# EAGLE design DAUGHTER_POWER (EAGLE 7.6.0)
DAUGHTER CARD POWER

## Sheet 1 of 3: HDK INTERFACE
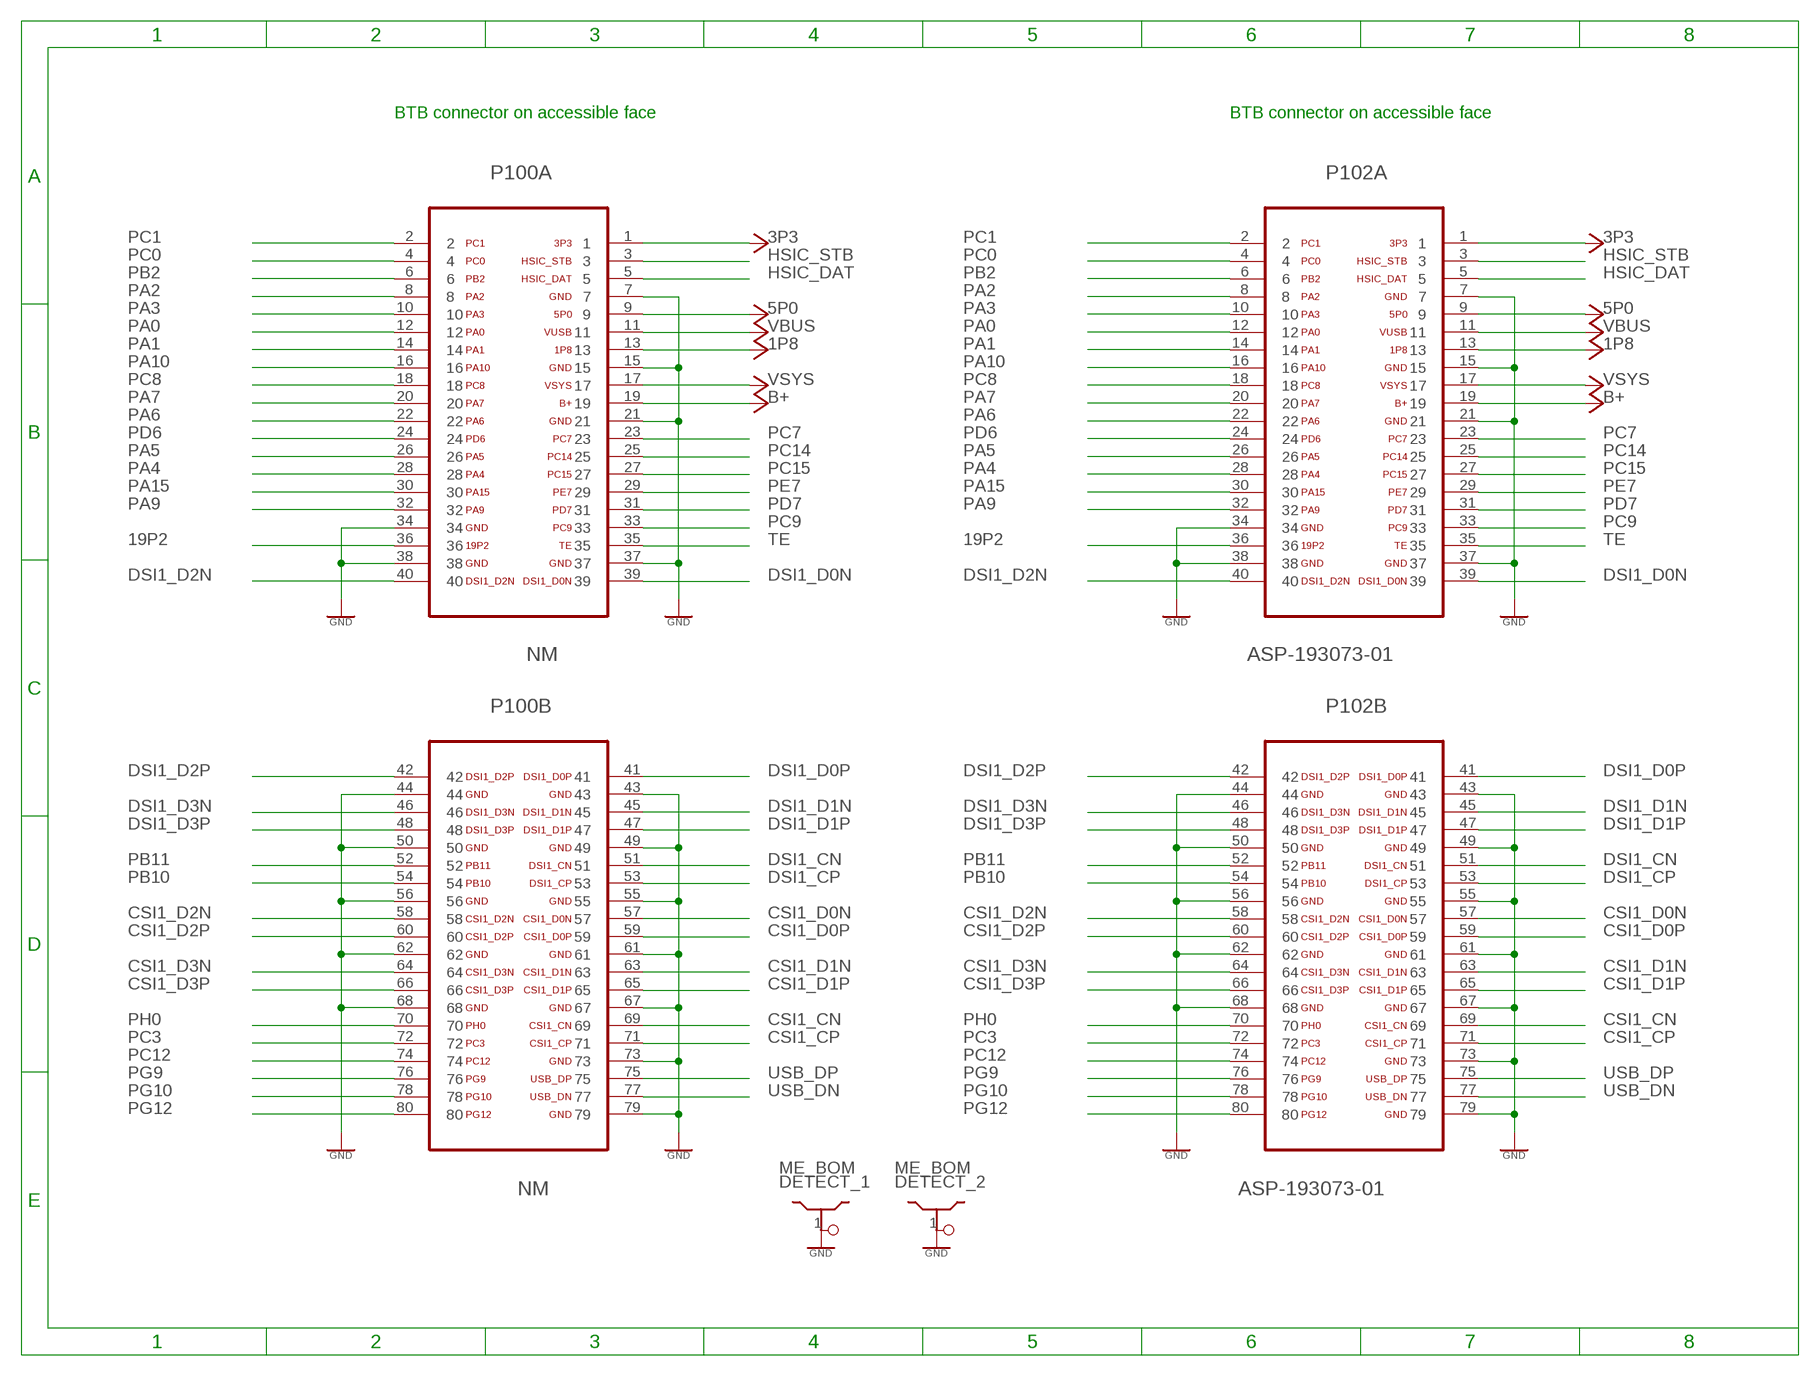
[diagram p0: schematic, sheet 1]

### Parts
DETECT_1  ME_BOM  SHIELDDETECT  [PLUG]
DETECT_2  ME_BOM  SHIELDDETECT  [PLUG]
P100  NM  CLM-140-02-L-D-KGOLD  [CLM-140-02-L-D-K_GOLD]
P102  ASP-193073-01  FTMH-140-02-L-DV-ES-P-TR  [FTMH-140-02-L-DV-ES-P-TR]

### Nets
1P8: P100.13 P102.13 ; also sheet 2,3
3P3: P100.1 P102.1 ; also sheet 2
5P0: P100.9 P102.9
19P2: P100.36 P102.36
B+: P100.19 P102.19
CSI1_CN: P100.69 P102.69
CSI1_CP: P100.71 P102.71
CSI1_D0N: P100.57 P102.57
CSI1_D0P: P100.59 P102.59
CSI1_D1N: P100.63 P102.63
CSI1_D1P: P100.65 P102.65
CSI1_D2N: P100.58 P102.58
CSI1_D2P: P100.60 P102.60
CSI1_D3N: P100.64 P102.64
CSI1_D3P: P100.66 P102.66
DSI1_CN: P100.51 P102.51
DSI1_CP: P100.53 P102.53
DSI1_D0N: P100.39 P102.39
DSI1_D0P: P100.41 P102.41
DSI1_D1N: P100.45 P102.45
DSI1_D1P: P100.47 P102.47
DSI1_D2N: P100.40 P102.40
DSI1_D2P: P100.42 P102.42
DSI1_D3N: P100.46 P102.46
DSI1_D3P: P100.48 P102.48
GND: DETECT_1.1 DETECT_2.1 P100.7 P100.15 P100.21 P100.34 P100.37 P100.38 P100.43 P100.44 P100.49 P100.50 P100.55 P100.56 P100.61 P100.62 P100.67 P100.68 P100.73 P100.79 P102.7 P102.15 P102.21 P102.34 P102.37 P102.38 P102.43 P102.44 P102.49 P102.50 P102.55 P102.56 P102.61 P102.62 P102.67 P102.68 P102.73 P102.79 ; also sheet 2,3
HSIC_DAT: P100.5 P102.5
HSIC_STB: P100.3 P102.3
PA0: P100.12 P102.12
PA1: P100.14 P102.14
PA2: P100.8 P102.8
PA3: P100.10 P102.10
PA4: P100.28 P102.28
PA5: P100.26 P102.26
PA6: P100.22 P102.22
PA7: P100.20 P102.20
PA9: P100.32 P102.32
PA10: P100.16 P102.16
PA15: P100.30 P102.30
PB2: P100.6 P102.6 ; also sheet 3
PB10: P100.54 P102.54 ; also sheet 2,3
PB11: P100.52 P102.52 ; also sheet 2,3
PC0: P100.4 P102.4
PC1: P100.2 P102.2
PC3: P100.72 P102.72
PC7: P100.23 P102.23 ; also sheet 3
PC8: P100.18 P102.18
PC9: P100.33 P102.33
PC12: P100.74 P102.74
PC14: P100.25 P102.25
PC15: P100.27 P102.27
PD6: P100.24 P102.24
PD7: P100.31 P102.31
PE7: P100.29 P102.29
PG9: P100.76 P102.76 ; also sheet 2
PG10: P100.78 P102.78 ; also sheet 3
PG12: P100.80 P102.80 ; also sheet 3
PH0: P100.70 P102.70
TE: P100.35 P102.35
USB_DN: P100.77 P102.77
USB_DP: P100.75 P102.75
VBUS: P100.11 P102.11 ; also sheet 3
VSYS: P100.17 P102.17 ; also sheet 3

### Notes on the sheet
- BTB connector on accessible face | BTB connector on accessible face

## Sheet 2 of 3: Identification
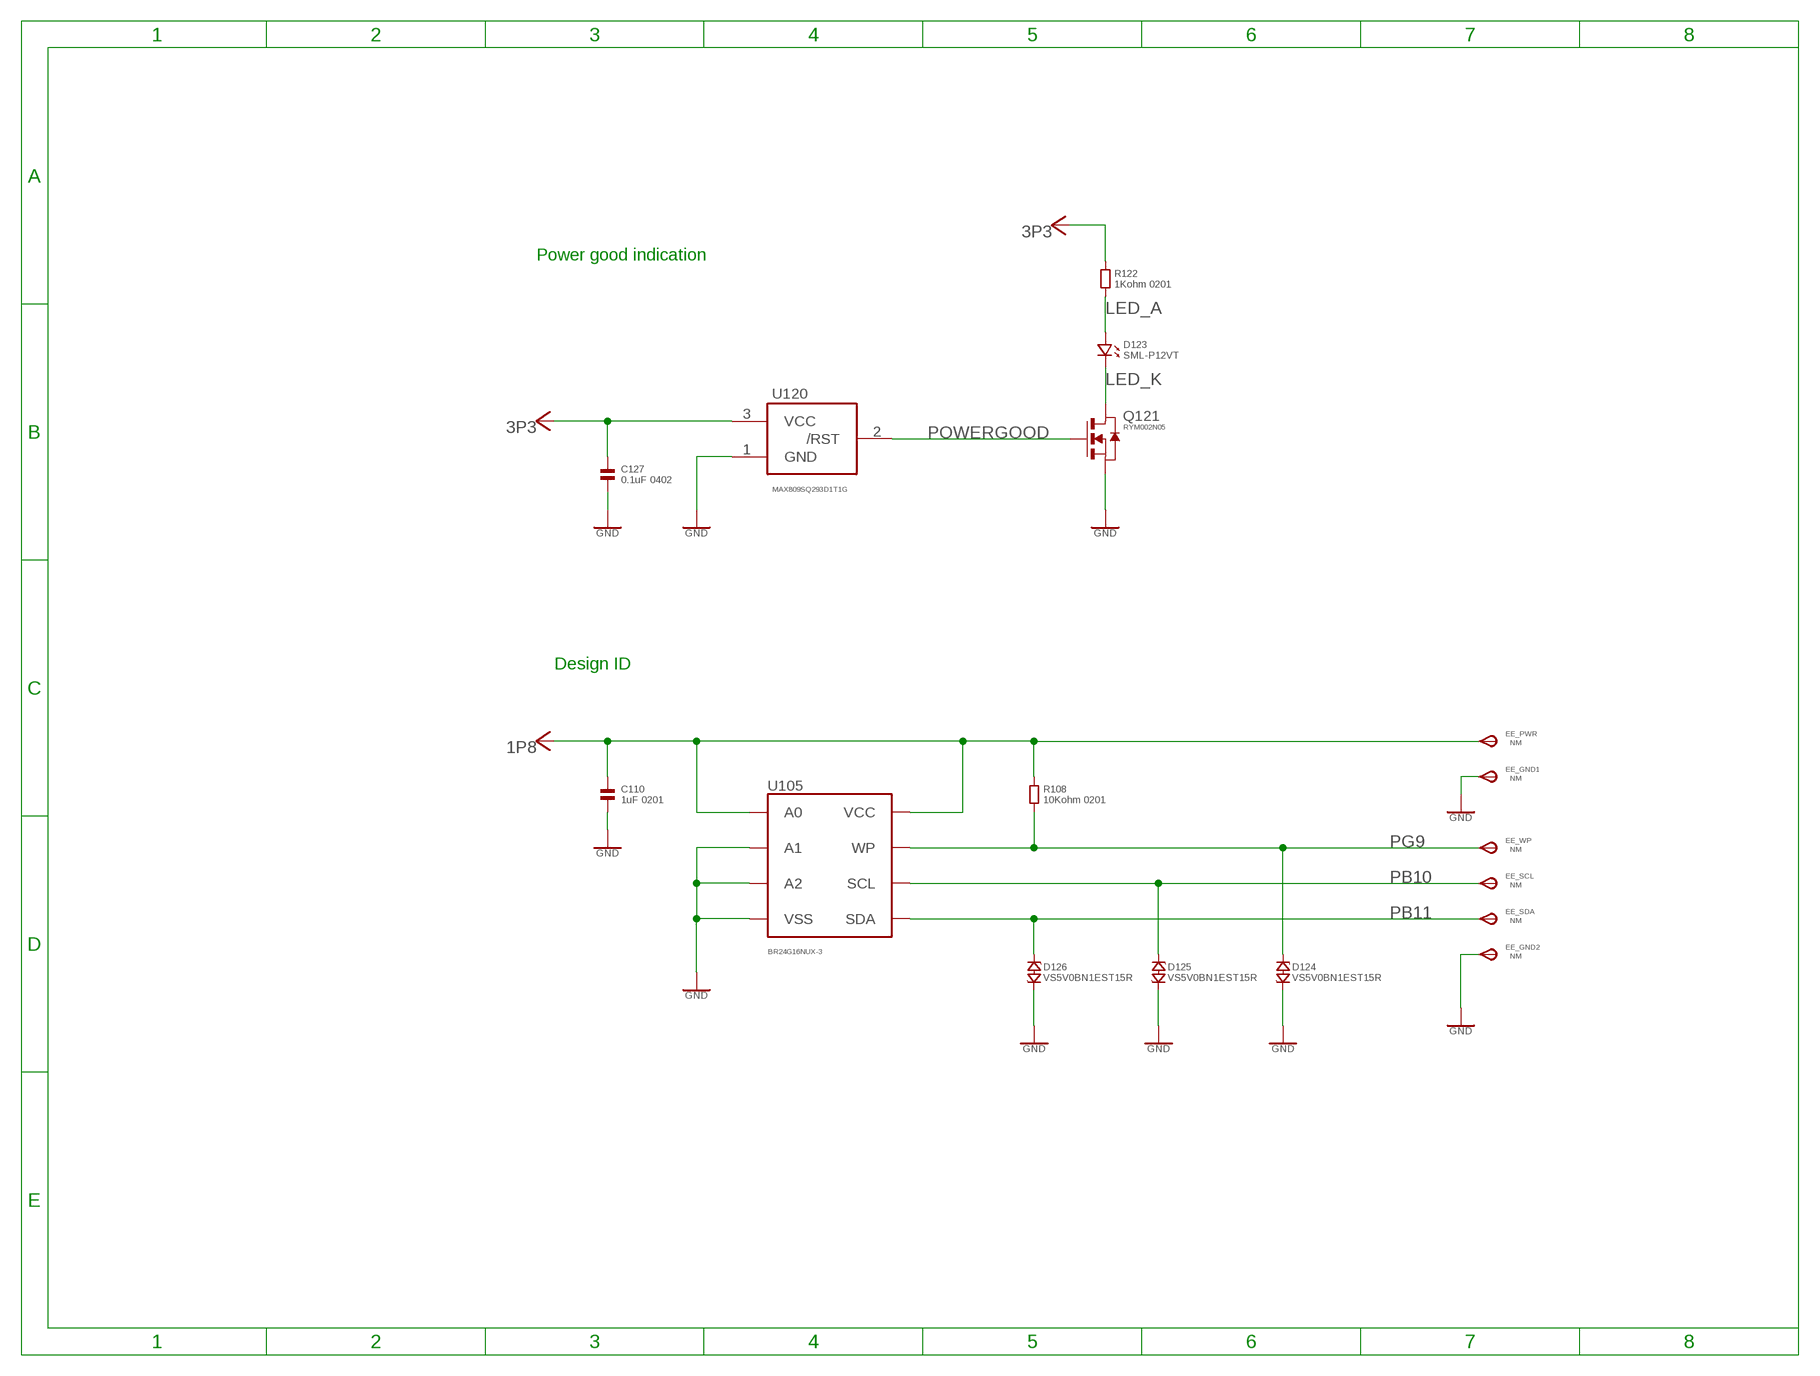
[diagram p1: schematic, sheet 2]

### Parts
C110  1uF 0201  CAPACITOR.0201  [0201]
C127  0.1uF 0402  CAPACITOR.0402  [0402]
D123  SML-P12VT  LED.0503  [0503.LED]
D124  VS5V0BN1EST15R  ESD_VARISTOR.0201  [CHIP_0201]
D125  VS5V0BN1EST15R  ESD_VARISTOR.0201  [CHIP_0201]
D126  VS5V0BN1EST15R  ESD_VARISTOR.0201  [CHIP_0201]
EE_GND1  NM  TPSTP11R  [TP11R]
EE_GND2  NM  TPSTP11R  [TP11R]
EE_PWR  NM  TPSTP11R  [TP11R]
EE_SCL  NM  TPSTP11R  [TP11R]
EE_SDA  NM  TPSTP11R  [TP11R]
EE_WP  NM  TPSTP11R  [TP11R]
Q121  RYM002N05  FET-NRYM002N05  [VMT3]
R108  10Kohm 0201  RESISTOR.0201  [0201]
R122  1Kohm 0201  RESISTOR.0201  [0201]
U105  BR24G16NUX-3  EEPROMDFN8  [DFN-8]
U120  MAX809SQ293D1T1G  MAX809  [SC70-3L]

### Nets
1P8: C110.1 EE_PWR.TP(PP) R108.1 U105.P$1(A0) U105.P$8(VCC) ; also sheet 1,3
3P3: C127.1 R122.1 U120.3(VCC) ; also sheet 1
GND: C110.2 C127.2 D124.P$2 D125.P$2 D126.P$2 EE_GND1.TP(PP) EE_GND2.TP(PP) Q121.2(S) U105.P$2(A1) U105.P$3(A2) U105.P$4(VSS) U105.P$9(VSS) U120.1(GND) ; also sheet 1,3
LED_A: D123.P$1 R122.2
LED_K: D123.P$2 Q121.3(D)
PB10: D125.P$1 EE_SCL.TP(PP) U105.P$6(SCL) ; also sheet 1,3
PB11: D126.P$1 EE_SDA.TP(PP) U105.P$5(SDA) ; also sheet 1,3
PG9: D124.P$1 EE_WP.TP(PP) R108.2 U105.P$7(WP) ; also sheet 1
POWERGOOD: Q121.1(G) U120.2(/RST)

### Notes on the sheet
- Power good indication
- Design ID

## Sheet 3 of 3: BATTERY
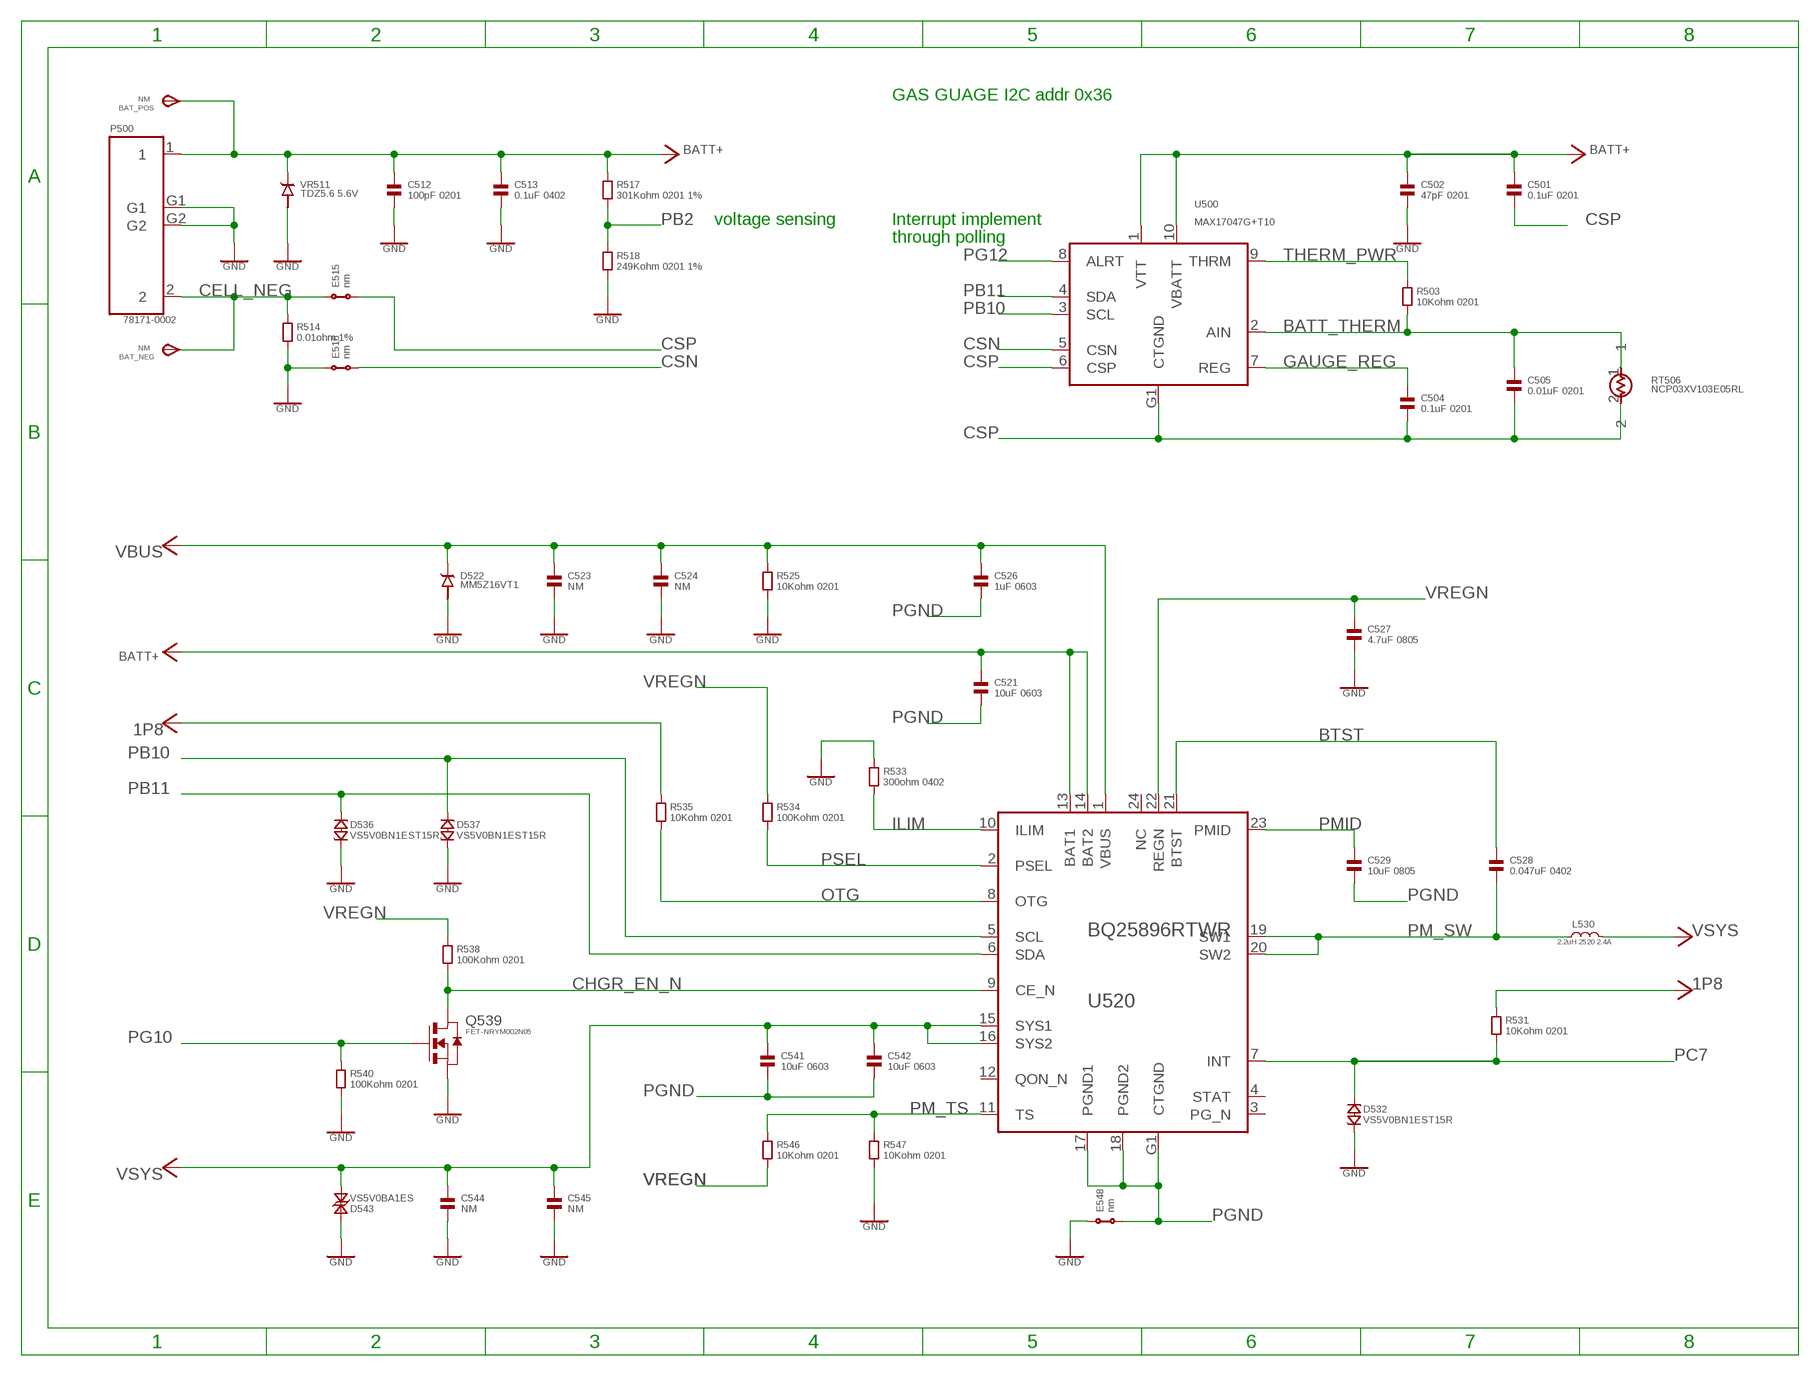
[diagram p2: schematic, sheet 3]

### Parts
BAT_NEG  NM  TPSTP11R  [TP11R]
BAT_POS  NM  TPSTP11R  [TP11R]
C501  0.1uF 0201  CAPACITOR.0201  [0201]
C502  47pF 0201  CAPACITOR.0201  [0201]
C504  0.1uF 0201  CAPACITOR.0201  [0201]
C505  0.01uF 0201  CAPACITOR.0201  [0201]
C512  100pF 0201  CAPACITOR.0201  [0201]
C513  0.1uF 0402  CAPACITOR.0402  [0402]
C521  10uF 0603  CAPACITOR.0603  [0603]
C523  NM  CAPACITOR.0201  [0201]
C524  NM  CAPACITOR.0201  [0201]
C526  1uF 0603  CAPACITOR.0603  [0603]
C527  4.7uF 0805  CAPACITOR.0805  [0805]
C528  0.047uF 0402  CAPACITOR.0402  [0402]
C529  10uF 0805  CAPACITOR.0805  [0805]
C541  10uF 0603  CAPACITOR.0603  [0603]
C542  10uF 0603  CAPACITOR.0603  [0603]
C544  NM  CAPACITOR.0201  [0201]
C545  NM  CAPACITOR.0201  [0201]
D522  MM5Z16VT1  DIODE.SOD523  [SOD523]
D532  VS5V0BN1EST15R  ESD_VARISTOR.0201  [CHIP_0201]
D536  VS5V0BN1EST15R  ESD_VARISTOR.0201  [CHIP_0201]
D537  VS5V0BN1EST15R  ESD_VARISTOR.0201  [CHIP_0201]
D543  VS5V0BA1ES  ESD_TVS.0201  [CHIP_0201]
E515  nm  SHORT_DOT  [SHORT_DOT]
E516  nm  SHORT_DOT  [SHORT_DOT]
E548  nm  SHORT_BAR  [1X4_SHORT]
L530  2.2uH 2520 2.4A  POWER-INDUCTOR  [2520]
P500  78171-0002  CONN_BATT  [CONN_4PIN]
Q539  FET-NRYM002N05  [VMT3]
R503  10Kohm 0201  RESISTOR.0201  [0201]
R514  0.01ohm 1%  RESISTOR.0805  [0805]
R517  301Kohm 0201 1%  RESISTOR.0201  [0201]
R518  249Kohm 0201 1%  RESISTOR.0201  [0201]
R525  10Kohm 0201  RESISTOR.0201  [0201]
R531  10Kohm 0201  RESISTOR.0201  [0201]
R533  300ohm 0402  RESISTOR.0402  [0402]
R534  100Kohm 0201  RESISTOR.0201  [0201]
R535  10Kohm 0201  RESISTOR.0201  [0201]
R538  100Kohm 0201  RESISTOR.0201  [0201]
R540  100Kohm 0201  RESISTOR.0201  [0201]
R546  10Kohm 0201  RESISTOR.0201  [0201]
R547  10Kohm 0201  RESISTOR.0201  [0201]
RT506  NCP03XV103E05RL  THERMISTOR  [0201]
U500  MAX17047G+T10  [DFN3X3_PS0_5P11]
U520  BQ25896RTWR  [QFN4X4PS0_5P25]
VR511  TDZ5.6 5.6V  DIODE  [DIO1_9X1_3]

### Nets
1P8: R531.1 R535.1 ; also sheet 1,2
BATT+: BAT_POS.TP(PP) C501.1 C502.1 C512.1 C513.1 C521.1 P500.1 R517.1 U500.1(VTT) U500.10(VBATT) U520.13(BAT1) U520.14(BAT2) VR511.1
BATT_THERM: C505.1 R503.2 RT506.1 U500.2(AIN)
BTST: C528.1 U520.21(BTST)
CELL_NEG: BAT_NEG.TP(PP) E515.1 P500.2 R514.1
CHGR_EN_N: Q539.3(D) R538.2 U520.9(CE_N)
CSN: E516.2 U500.5(CSN)
CSP: C501.2 C504.2 C505.2 E515.2 RT506.2 U500.6(CSP) U500.G1(CTGND)
GAUGE_REG: C504.1 U500.7(REG)
GND: C502.2 C512.2 C513.2 C523.2 C524.2 C527.2 C544.2 C545.2 D522.2 D532.P$2 D536.P$2 D537.P$2 D543.P$1 E516.1 E548.1 P500.G1 P500.G2 Q539.2(S) R514.2 R518.2 R525.2 R533.1 R540.2 R547.2 VR511.2 ; also sheet 1,2
ILIM: R533.2 U520.10(ILIM)
OTG: R535.2 U520.8(OTG)
PB2: R517.2 R518.1 ; also sheet 1
PB10: D537.P$1 U500.3(SCL) U520.5(SCL) ; also sheet 1,2
PB11: D536.P$1 U500.4(SDA) U520.6(SDA) ; also sheet 1,2
PC7: D532.P$1 R531.2 U520.7(INT) ; also sheet 1
PG10: Q539.1(G) R540.1 ; also sheet 1
PG12: U500.8(ALRT) ; also sheet 1
PGND: C521.2 C526.2 C529.2 C541.2 C542.2 E548.2 U520.17(PGND1) U520.18(PGND2) U520.G1(CTGND)
PM_SW: C528.2 L530.G1 U520.19(SW1) U520.20(SW2)
PM_TS: R546.1 R547.1 U520.11(TS)
PMID: C529.1 U520.23(PMID)
PSEL: R534.2 U520.2(PSEL)
THERM_PWR: R503.1 U500.9(THRM)
VBUS: C523.1 C524.1 C526.1 D522.1 R525.1 U520.1(VBUS) ; also sheet 1
VREGN: C527.1 R534.1 R538.1 R546.2 U520.22(REGN)
VSYS: C541.1 C542.1 C544.1 C545.1 D543.P$2 L530.G2 U520.15(SYS1) U520.16(SYS2) ; also sheet 1
Unconnected: U520.3(PG_N) U520.4(STAT) U520.12(QON_N) U520.24(NC)

### Notes on the sheet
- GAS GUAGE I2C addr 0x36
- voltage sensing | Interrupt implement
- through polling

## Library data of the parts
BAT_NEG BAT_POS EE_GND1 EE_GND2 EE_PWR EE_SCL EE_SDA EE_WP = MOTO_LIB:TPS: TEST Point, 1mm diameter, gold
C110 C127 C501 C502 C504 C505 C512 C513 C521 C523 C524 C526-C529 C541 C542 C544 C545 = MOTO_LIB:CAPACITOR: Ceramic Capacitor, Generic
D123 = MOTO_LIB:LED: LED GENERIC, single, 2 pin; MPN: SML-P12VT; SUPPLIER: ROHM
D124-D126 D532 D536 D537 = MOTO_LIB:ESD_VARISTOR: GENERIC varistor,single, 2 pin; MPN: VS5V0BN1EST15R; SUPPLIER: ROHM
D522 = MOTO_LIB:DIODE: DIODE GENERIC, single, 2 pin; MPN: MM5Z16VT1; SUPPLIER: ON_SEMI
D543 = MOTO_LIB:ESD_TVS: GENERIC TVS,single, 2 pin; MPN: UCLAMP1211Z; SUPPLIER: SEMTECH
DETECT_1 DETECT_2 = MOTO_LIB:SHIELD: Shield, Custom; MPN: refer to ME BOM; SUPPLIER: ref to ME BOM
E515 E516 = MOTO_LIB:SHORT_DOT: short dot, layout feature
E548 = MOTO_LIB:SHORT_BAR: SHORT BAR - layout feature
L530 = MOTO_LIB:POWER-INDUCTOR: Inductor, Power
P100 = MOTO_LIB:CLM-140-02-L-D-K: MICRO SOCKET, 1.0MM pitch, SMD, 2X40WAY, Female; MPN: CLM-140-02-L-D-K; SUPPLIER: SAMTEC
P102 = MOTO_LIB:FTMH-140-02-L-DV-ES-P-TR: MICRO SOCKET, 1.0MM, SMD, 2X40WAY, MALE; MPN: ASP-193073-01; SUPPLIER: SAMTEC
P500 = MOTO_LIB:CONN_BATT: BATTERY connector; MPN: 78171-0002; SUPPLIER: MOLEX
Q121 Q539 = MOTO_LIB:FET-N: Generic NMOS FET; MPN: RYM002N05; SUPPLIER: ROHM
R108 R122 R503 R514 R517 R518 R525 R531 R533-R535 R538 R540 R546 R547 = MOTO_LIB:RESISTOR: Resistor - Generic
RT506 = MOTO_LIB:THERMISTOR: Thmistor, NTC 10Khm 3%, 0201; MPN: NCP03XV103XV103E05RL/NTCG0603UH103HT; SUPPLIER: MURARA/TDK
U105 = MOTO_LIB:EEPROM: I2C EE PROM, 8 pin; MPN: BR24G16NUX-3; SUPPLIER: ROHM
U120 = MOTO_LIB:MAX809: 3-Pin Microprocessor Reset Circuit; MPN: MAX809SQ293D1T1; SUPPLIER: ON-SEMI
U500 = MOTO_LIB:MAX17047G+T10: Fuel Guage; MPN: MAX17047G+T10; SUPPLIER: MAXIM
U520 = MOTO_LIB:BQ25896RTWR: Charging IC, TI BQ2589x; MPN: BQ25896RTWR; SUPPLIER: TI
VR511 = MOTO_LIB:DIODE: DIODE GENERIC, single, 2 pin; MPN: TDZ5.6B; SUPPLIER: ROHM

## Board
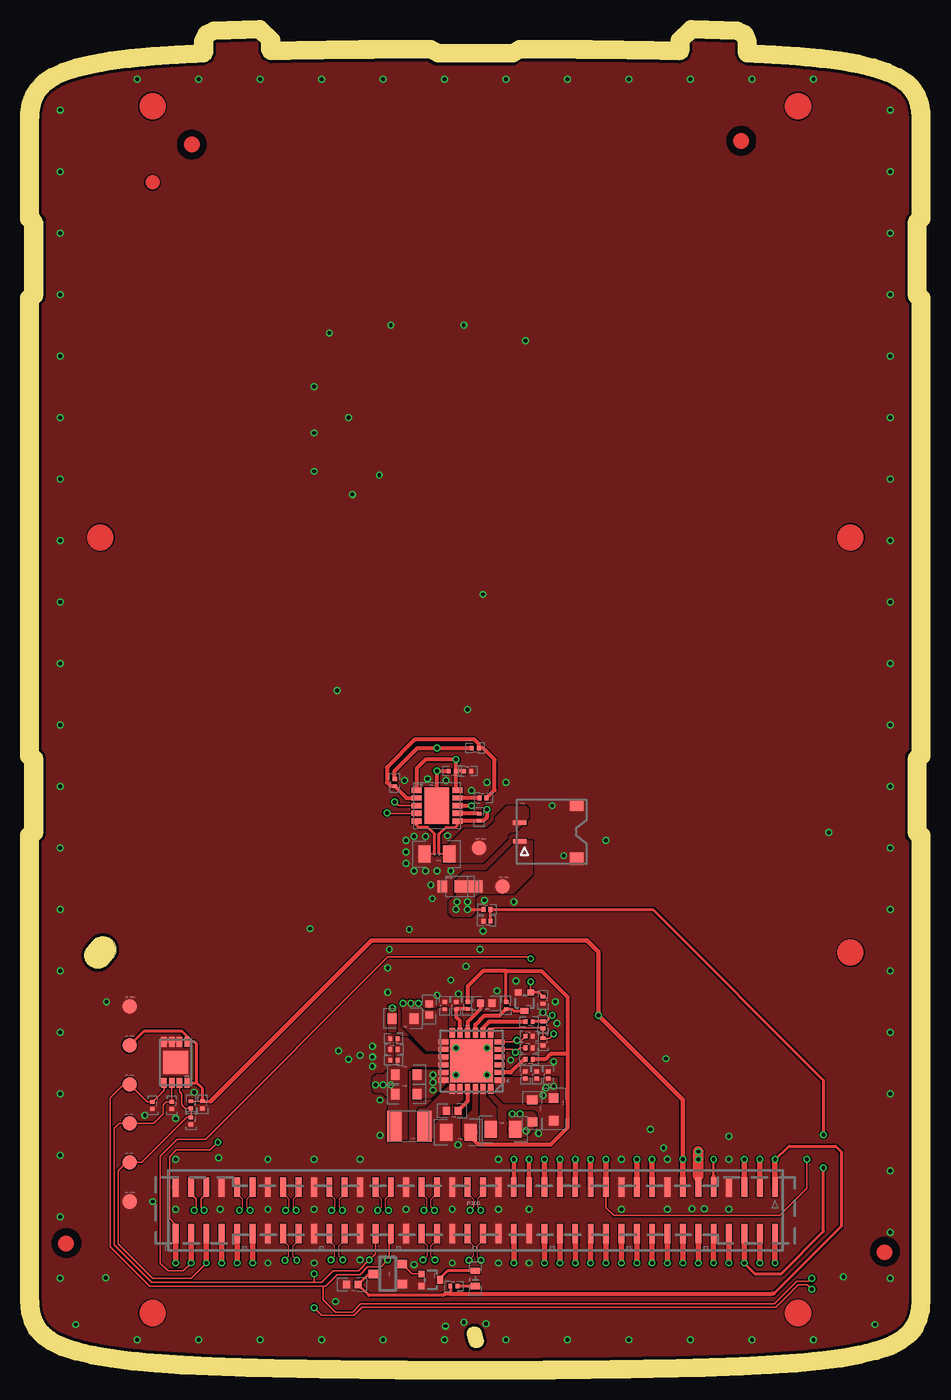
[diagram p3: board, top side]
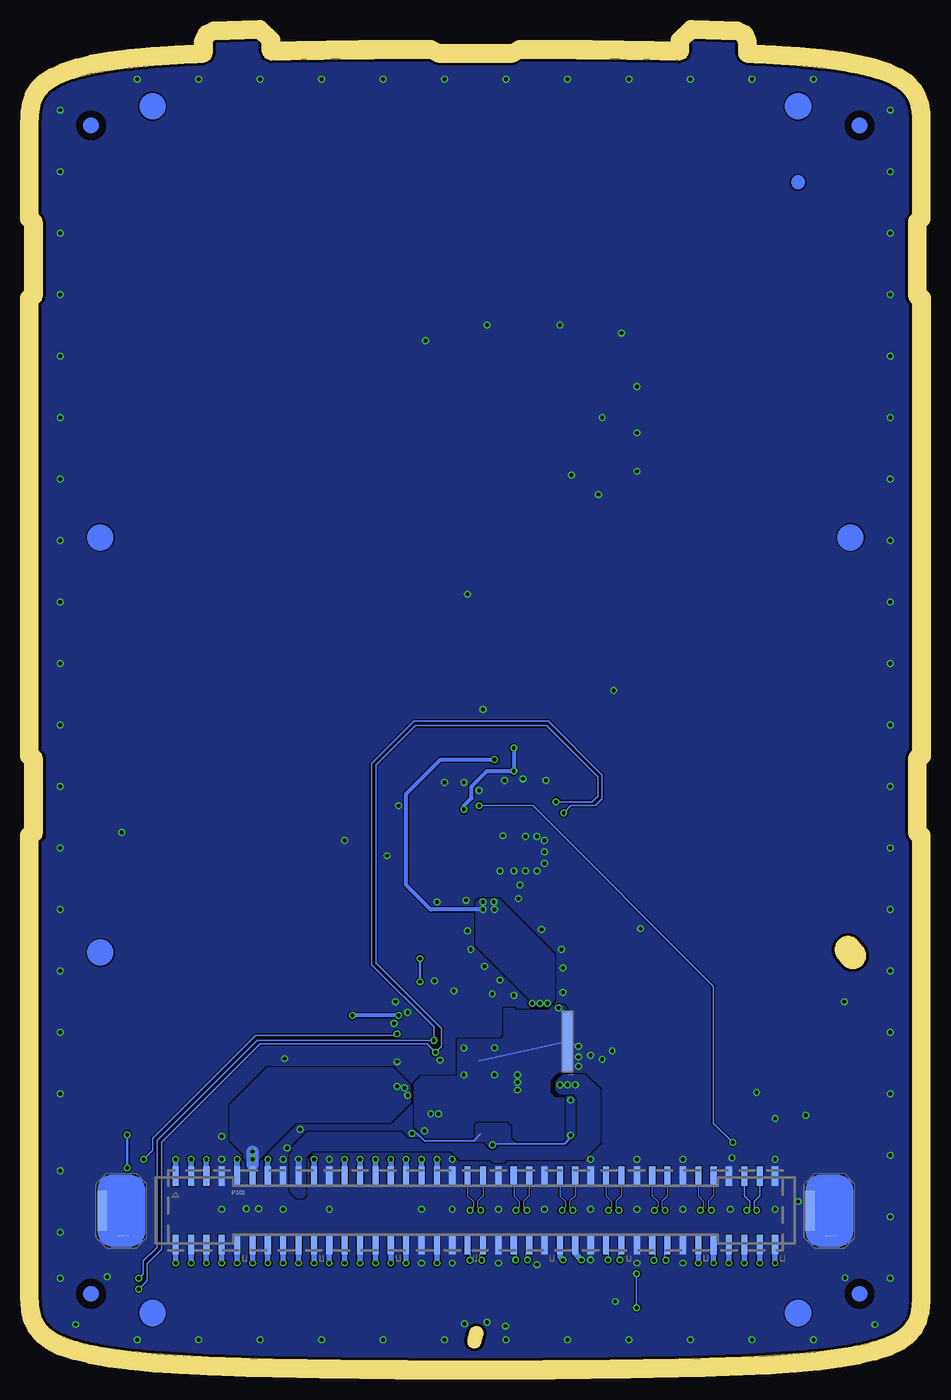
[diagram p4: board, bottom side, seen from below]

Size 56.85 x 86.03 mm. Coordinates in mm from the lower left corner, seen from the top.
Outline: 357 segments
Copper layers (1*16): Top 0.03mm / dielectric 0.787mm / Bottom 0.03mm
Design rules "constraint *": minimum track width 0.08mm, minimum drill 0.25mm, track to track 0.08mm, track to pad 0.08mm, pad to pad 0.08mm, via to via 0.08mm, smd to smd 0.08mm, copper to edge 0.2mm, drill to drill 0.2mm, minimum pad ring 0.1mm, minimum via ring 0.1mm, stop-mask expansion 0mil, vias tented up to drill 0.25mm, thermal gap 0mil
tRestrict: area 54.2,6.2 to 56,7.1; area 54.2,7.1 to 56,8; area 44.8,79.4 to 46.6,80.3; area 44.8,78.5 to 46.6,79.4; area 9.1,79.1 to 10.9,80; area 9.1,78.2 to 10.9,79.1; area 0.9,6.8 to 2.7,7.7; area 0.9,7.7 to 2.7,8.6
bRestrict: area 52.5,4.4 to 54.3,5.3; area 52.5,3.5 to 54.3,4.4; area 2.5,4.4 to 4.3,5.3; area 2.5,3.5 to 4.3,4.4; area 2.5,79.5 to 4.3,80.4; area 2.5,80.4 to 4.3,81.3; area 52.5,80.4 to 54.3,81.3; area 52.5,79.5 to 54.3,80.4
Milling: 125 lines

### Footprints (pad centres in the part's own frame; a part is rotated, then mirrored left to right if it is on the bottom)
TP11R = smd 0.95 x 0.95: TP 0,0
0201 = smd 0.25 x 0.3: 1 -0.23,0; 2 0.23,0
0402 = smd 0.45 x 0.5: 1 -0.37,0; 2 0.37,0
0603 = smd 0.58 x 0.68: 1 -0.71,0; 2 0.71,0
0805 = smd 0.8 x 1.1: 1 -0.8,0; 2 0.8,0
0503.LED = smd 0.4 x 0.6: P$1 -0.495,0; P$2 0.495,0
CHIP_0201 = smd 0.25 x 0.3: P$1 -0.23,0; P$2 0.23,0
SOD523 = smd 0.64 x 0.59: 1 -0.73,0; 2 0.73,0
PLUG = smd 0.6 x 2.6: 1 -1.25,0
SHORT_DOT = smd 0.05 x 0.05: 1 -0.01,0; 2 0.01,0
1X4_SHORT = smd 0.4 x 4: 1 -0.15,0; 2 0.15,0
2520 = smd 0.95 x 2: G1 -0.975,0; G2 0.975,0
CLM-140-02-L-D-K_GOLD = smd 0.38 x 1.27: 1 19.5,1.52; 2 19.5,-1.52; 3 18.5,1.52; 4 18.5,-1.52; 5 17.5,1.52; 6 17.5,-1.52; 7 16.5,1.52; 8 16.5,-1.52; 9 15.5,1.52; 10 15.5,-1.52; 11 14.5,1.52; 12 14.5,-1.52; 13 13.5,1.52; 14 13.5,-1.52; 15 12.5,1.52; 16 12.5,-1.52; 17 11.5,1.52; 18 11.5,-1.52; 19 10.5,1.52; 20 10.5,-1.52; 21 9.5,1.52; 22 9.5,-1.52; 23 8.5,1.52; 24 8.5,-1.52; 25 7.5,1.52; 26 7.5,-1.52; 27 6.5,1.52; 28 6.5,-1.52; 29 5.5,1.52; 30 5.5,-1.52; 31 4.5,1.52; 32 4.5,-1.52; 33 3.5,1.52; 34 3.5,-1.52; 35 2.5,1.52; 36 2.5,-1.52; 37 1.5,1.52; 38 1.5,-1.52; 39 0.5,1.52; 40 0.5,-1.52; 41 -0.5,1.52; 42 -0.5,-1.52; 43 -1.5,1.52; 44 -1.5,-1.52; 45 -2.5,1.52; 46 -2.5,-1.52; 47 -3.5,1.52; 48 -3.5,-1.52; 49 -4.5,1.52; 50 -4.5,-1.52; 51 -5.5,1.52; 52 -5.5,-1.52; 53 -6.5,1.52; 54 -6.5,-1.52; 55 -7.5,1.52; 56 -7.5,-1.52; 57 -8.5,1.52; 58 -8.5,-1.52; 59 -9.5,1.52; 60 -9.5,-1.52; 61 -10.5,1.52; 62 -10.5,-1.52; 63 -11.5,1.52; 64 -11.5,-1.52; 65 -12.5,1.52; 66 -12.5,-1.52; 67 -13.5,1.52; 68 -13.5,-1.52; 69 -14.5,1.52; 70 -14.5,-1.52; 71 -15.5,1.52; 72 -15.5,-1.52; 73 -16.5,1.52; 74 -16.5,-1.52; 75 -17.5,1.52; 76 -17.5,-1.52; 77 -18.5,1.52; 78 -18.5,-1.52; 79 -19.5,1.52; 80 -19.5,-1.52
FTMH-140-02-L-DV-ES-P-TR = smd 0.4 x 1.263: 1 -19.5,2.223; 2 -19.5,-2.223; 3 -18.5,2.223; 4 -18.5,-2.223; 5 -17.5,2.223; 6 -17.5,-2.223; 7 -16.5,2.223; 8 -16.5,-2.223; 9 -15.5,2.223; 10 -15.5,-2.223; 11 -14.5,2.223; 12 -14.5,-2.223; 13 -13.5,2.223; 14 -13.5,-2.223; 15 -12.5,2.223; 16 -12.5,-2.223; 17 -11.5,2.223; 18 -11.5,-2.223; 19 -10.5,2.223; 20 -10.5,-2.223; 21 -9.5,2.223; 22 -9.5,-2.223; 23 -8.5,2.223; 24 -8.5,-2.223; 25 -7.5,2.223; 26 -7.5,-2.223; 27 -6.5,2.223; 28 -6.5,-2.223; 29 -5.5,2.223; 30 -5.5,-2.223; 31 -4.5,2.223; 32 -4.5,-2.223; 33 -3.5,2.223; 34 -3.5,-2.223; 35 -2.5,2.223; 36 -2.5,-2.223; 37 -1.5,2.223; 38 -1.5,-2.223; 39 -0.5,2.223; 40 -0.5,-2.223; 41 0.5,2.223; 42 0.5,-2.223; 43 1.5,2.223; 44 1.5,-2.223; 45 2.5,2.223; 46 2.5,-2.223; 47 3.5,2.223; 48 3.5,-2.223; 49 4.5,2.223; 50 4.5,-2.223; 51 5.5,2.223; 52 5.5,-2.223; 53 6.5,2.223; 54 6.5,-2.223; 55 7.5,2.223; 56 7.5,-2.223; 57 8.5,2.223; 58 8.5,-2.223; 59 9.5,2.223; 60 9.5,-2.223; 61 10.5,2.223; 62 10.5,-2.223; 63 11.5,2.223; 64 11.5,-2.223; 65 12.5,2.223; 66 12.5,-2.223; 67 13.5,2.223; 68 13.5,-2.223; 69 14.5,2.223; 70 14.5,-2.223; 71 15.5,2.223; 72 15.5,-2.223; 73 16.5,2.223; 74 16.5,-2.223; 75 17.5,2.223; 76 17.5,-2.223; 77 18.5,2.223; 78 18.5,-2.223; 79 19.5,2.223; 80 19.5,-2.223
CONN_4PIN = smd 0.88 x 0.3: 1 -2.075,-0.6; 2 -2.075,0.6 | smd 0.9 x 0.8: G1 1.645,-1.75; G2 1.645,1.75
VMT3 = smd 0.42 x 0.4: 1 -0.4,-0.6; 2 0.4,-0.6 | smd 0.52 x 0.4: 3 0,0.6
DFN-8 = smd 0.35 x 0.65: P$1 -0.75,-1.325; P$2 -0.25,-1.325; P$3 0.25,-1.325; P$4 0.75,-1.325; P$5 0.75,1.325; P$6 0.25,1.325; P$7 -0.25,1.325; P$8 -0.75,1.325 | smd 1.6 x 1.5: P$9 0,0
SC70-3L = smd 0.55 x 0.63: 1 -0.65,-0.94; 3 0,0.94 | smd 0.555 x 0.63: 2 0.65,-0.94
DFN3X3_PS0_5P11 = smd 0.65 x 0.35: 1 -1.325,1; 2 -1.325,0.5; 3 -1.325,0; 4 -1.325,-0.5; 5 -1.325,-1; 6 1.325,-1; 7 1.325,-0.5; 8 1.325,0; 9 1.325,0.5; 10 1.325,1 | smd 1.6 x 2.4: G1 0,0
QFN4X4PS0_5P25 = smd 0.65 x 0.33: 1 1.825,-1.25; 2 1.825,-0.75; 3 1.825,-0.25; 4 1.825,0.25; 5 1.825,0.75; 6 1.825,1.25; 13 -1.825,1.25; 14 -1.825,0.75; 15 -1.825,0.25; 16 -1.825,-0.25; 17 -1.825,-0.75; 18 -1.825,-1.25 | smd 0.33 x 0.65: 7 1.25,1.825; 8 0.75,1.825; 9 0.25,1.825; 10 -0.25,1.825; 11 -0.75,1.825; 12 -1.25,1.825; 19 -1.25,-1.825; 20 -0.75,-1.825; 21 -0.25,-1.825; 22 0.25,-1.825; 23 0.75,-1.825; 24 1.25,-1.825 | smd 2.8 x 2.8: G1 0,0
DIO1_9X1_3 = smd 1.8 x 0.8: 1 0.55,0 | smd 0.6 x 0.8: 2 -1.15,0

### Placement (x,y rotation side)
BAT_NEG  28.67,33.37 0 top
BAT_POS  30.17,30.87 0 top
C110  10.67,16.67 270 top
C127  20.42,4.97 180 top
C501  26.92,38.37 180 top
C502  27.92,38.37 0 top
C504  28.67,35.37 270 top
C505  23.17,37.62 90 top
C512  26.42,23.12 90 top
C513  25.42,22.87 90 top
C521  23.72,22.27 180 top
C523  32.42,18.62 90 top
C524  31.67,18.62 90 top
C526  32.12,16.27 270 top
C527  27.32,14.87 180 top
C528  26.92,16.27 180 top
C529  30.22,15.07 0 top
C541  23.92,18.62 0 top
C542  23.92,17.37 0 top
C544  23.12,19.57 180 top
C545  23.12,20.97 180 top
D123  28.42,5.37 90 top
D124  9.92,15.62 270 top
D125  8.67,16.62 270 top
D126  7.42,16.62 270 top
D522  33.52,16.37 270 top
D532  32.82,20.77 270 top
D536  31.92,21.12 0 top
D537  31.92,20.37 0 top
D543  23.12,20.27 0 top
DETECT_1  51.45,9.77 0 bottom
DETECT_2  5.39,9.77 0 bottom
E515  26.07,32.97 0 top
E516  25.77,32.97 0 top
E548  22.42,20.77 180 bottom
EE_GND1  5.92,10.37 0 top
EE_GND2  5.92,23.07 0 top
EE_PWR  5.92,20.53 0 top
EE_SCL  5.92,15.45 0 top
EE_SDA  5.92,17.99 0 top
EE_WP  5.92,12.91 0 top
L530  24.12,15.27 180 top
P100  28.42,9.8 0 top
P102  28.42,9.8 0 bottom
P500  33.37,34.42 0 top
Q121  25.52,5.27 270 top
Q539  31.62,23.37 180 top
R108  9.92,16.67 270 top
R122  27.02,4.87 0 top
R503  28.92,36.62 0 top
R514  25.92,32.97 180 top
R517  29.17,29.37 0 top
R518  29.17,28.62 180 top
R525  33.17,18.62 90 top
R531  32.82,21.87 270 top
R533  29.12,23.27 180 top
R534  31.92,19.62 180 top
R535  31.92,22.07 180 top
R538  30.42,23.12 270 top
R540  32.82,23.47 270 top
R546  27.92,23.12 90 top
R547  27.17,23.12 90 top
RT506  28.42,39.87 180 top
U105  8.92,19.42 180 top
U120  22.72,5.67 90 top
U500  25.92,36.12 0 top
U520  28.17,19.52 0 top
VR511  27.42,30.87 0 top

### Tracks (layer width: path | path; a pad name or v marks a point on that pad's centre or on a via)
1P8  (via drill 0.25)
  Top 0.1: R108.1 C110.1
  Top 0.2: EE_PWR.TP 6.86,21.47 9.32,21.47 9.67,21.12 U105.P$1 10.15,20.75 10.3,20.6 10.3,18.1 | U105.P$8 10.3,18.1 | 10.3,18.1 10.67,17.72 C110.1 11.2,16.9 | R535.1 32.18,22.1 R531.1 33.05,22.1 v33.42,22.47
  Top 0.3: 11.2,16.9 21.67,27.37 35.67,27.37 36.42,26.62 v36.42,22.47 41.92,16.97 v41.92,13.12
  Top 0.35: P100.13 v41.92,13.12
  Bottom 0.25: v33.42,22.47 v36.42,22.47
  Bottom 0.35: P102.13 v41.92,13.12
3P3  (via drill 0.25)
  Top 0.2: U120.3 21.49,5.67 C127.1 21.49,4.27 26.32,4.27 26.42,4.37 | R122.1 26.79,4.37 | 47.92,13.07 48.82,13.97 51.87,13.97 52.22,13.62 52.22,8.77 47.83,4.38
  Top 0.25: 26.42,4.37 26.79,4.37 47.67,4.37 47.83,4.38
  Top 0.35: P100.1 v47.92,13.12 47.92,13.07
  Bottom 0.35: P102.1 v47.92,13.12
5P0  (via drill 0.25)
  Top 0.15: v43.92,13.12 P102.9
  Top 0.25: P100.9 P102.9
  Bottom 0.4: P102.9 v43.92,13.12
19P2  (via drill 0.25)
  Top 0.35: P100.36 v30.92,6.37
  Bottom 0.35: v30.92,6.37 P102.36
B+  (via drill 0.25)
  Top 0.35: P100.19 v38.92,13.12
  Bottom 0.35: v38.92,13.12 P102.19
BATT+  (via drill 0.25)
  Top 0.1: v27.17,39.12 27.15,39.1
  Top 0.2: v27.92,29.37 R517.1
  Top 0.25: U500.1 24.6,38.55 25.17,39.12 v27.17,39.12 | C501.1 27.15,39.1 | C501.1 27.15,37.22 U500.10 | C502.1 C501.1
  Bottom 0.25: v27.92,29.37 31.32,29.37 32.92,30.97 32.92,36.87 30.67,39.12 v27.17,39.12
  other vias: 27.92,29.87 27.22,29.87 27.17,29.37 23.72,23.27 24.22,23.27 24.72,23.27
  pour Bottom: 23.27,23.52 23.67,23.12 24.82,23.12 24.87,23.17 24.87,23.62 24.92,23.62 28.37,27.07 28.37,29.87 28.17,30.07 26.92,30.07 23.27,26.42
  pour Top: 32.12,33.82 30.97,33.82 30.97,33.57 29.22,31.82 27.72,31.82 27.22,31.32 27.22,30.32 26.72,29.82 26.72,29.17 26.97,28.92 28.12,28.92 28.37,29.17 28.37,30.17 28.62,30.42 30.87,30.42 32.12,31.67
  pour Top: 23.67,23.42 24.77,23.42 24.87,23.32 24.87,22.92 24.97,22.82 25.92,22.82 26.02,22.92 26.57,22.92 26.57,20.22 25.27,20.22 23.67,21.82 23.67,22.92 23.62,22.97 23.62,23.37
BATT_THERM
  Top 0.25: R503.2 29.67,37.14 29.67,39.12 28.92,39.87 RT506.1 28.65,40.14 28.37,40.42 24.47,40.42 22.67,38.62 22.67,37.62 22.9,37.39 C505.1 23.94,36.62 U500.2
BTST
  Top 0.25: U520.21 27.92,16.9 C528.1
CELL_NEG
  Top 0.1: E515.1 R514.1 E515.1
  pour Top: 27.72,34.57 29.22,34.57 29.72,35.07 29.72,35.32 30.47,36.07 31.67,36.07 31.87,35.87 31.87,35.37 30.92,34.42 30.67,34.42 30.47,34.22 30.47,34.02 28.87,32.42 26.47,32.42 26.47,33.32
CHGR_EN_N
  Top 0.2: R538.2 30.8,22.89 30.92,22.77 Q539.3
  Top 0.25: U520.9 28.42,21.87 29.02,22.47 30,22.47 R538.2
CSI1_CN  (via drill 0.25)
  Top 0.08: P100.69 13.92,10.9 13.57,10.55 13.57,10 v13.77,9.8
  Bottom 0.08: P102.69 13.92,10.75 13.57,10.4 13.57,10 v13.77,9.8
CSI1_CP  (via drill 0.25)
  Top 0.08: P100.71 12.92,10.9 13.29,10.53 13.29,10.02 v13.07,9.8
  Bottom 0.08: P102.71 12.92,10.75 13.27,10.4 13.27,10 v13.07,9.8
CSI1_D0N  (via drill 0.25)
  Top 0.08: P100.57 19.92,10.9 19.55,10.53 19.55,10.02 v19.77,9.8
  Bottom 0.08: P102.57 19.92,10.75 19.57,10.4 19.57,10 v19.77,9.8
CSI1_D0P  (via drill 0.25)
  Top 0.08: P100.59 18.92,10.9 19.27,10.55 19.27,10 v19.07,9.8
  Bottom 0.08: P102.59 18.92,10.75 19.29,10.38 19.29,10.02 v19.07,9.8
CSI1_D1N  (via drill 0.25)
  Top 0.08: P100.63 16.92,10.9 16.55,10.53 16.55,10.02 v16.77,9.8
  Bottom 0.08: P102.63 16.92,10.75 16.55,10.38 16.55,10.02 v16.77,9.8
CSI1_D1P  (via drill 0.25)
  Top 0.08: 15.92,10.9 16.27,10.55 16.27,10 v16.07,9.8
  Top 0.1: P100.65 15.92,10.9
  Bottom 0.08: P102.65 15.92,10.75 16.27,10.4 16.27,10 v16.07,9.8
CSI1_D2N  (via drill 0.25)
  Top 0.08: P100.58 19.92,7.85 19.57,7.5 19.57,6.8 v19.8,6.58
  Bottom 0.08: P102.58 19.92,7.17 19.72,6.97 19.72,6.65 v19.8,6.58
CSI1_D2P  (via drill 0.25)
  Top 0.08: P100.60 18.92,7.85 19.27,7.5 19.27,6.82 v19.03,6.58
  Bottom 0.08: P102.60 18.92,7.15 19.12,6.95 19.12,6.67 v19.03,6.58
CSI1_D3N  (via drill 0.25)
  Top 0.08: P100.64 16.92,7.85 16.57,7.5 16.57,6.8 v16.81,6.57
  Bottom 0.08: P102.64 16.92,7.12 16.72,6.92 16.72,6.65 v16.81,6.57
CSI1_D3P  (via drill 0.25)
  Top 0.08: P100.66 15.92,7.85 16.27,7.5 16.27,6.8 v16.03,6.57
  Bottom 0.08: P102.66 15.92,7.12 16.12,6.92 16.12,6.65 v16.03,6.57
CSN
  Top 0.1: E516.2 25.77,33.37
  Top 0.2: E516.2 25.77,33.37 25.77,34.27 25.32,34.72 24.72,34.72 24.6,34.85 U500.5
CSP  (via drill 0.25)
  Top 0.1: 27.27,35.14 U500.6 | E515.2
  Top 0.2: E515.2 26.07,34.27 26.52,34.72 27.12,34.72 27.25,34.85 U500.6
  Top 0.25: 27.27,35.14 C504.2 28.94,35.14 29.17,35.37 v29.17,35.87 | C501.2 v25.92,38.37 U500.G1 | RT506.2 v25.92,39.87 24.67,39.87 23.17,38.37 C505.2
  Bottom 0.25: v29.17,35.87 29.17,36.12 28.67,36.62 28.67,37.37 27.67,38.37 v25.92,38.37 v25.92,39.87
DSI1_CN  (via drill 0.25)
  Top 0.08: 22.92,10.9 22.55,10.53 22.55,10.02 v22.77,9.8
  Top 0.1: P100.51 22.92,10.9
  Bottom 0.08: P102.51 22.92,10.75 22.57,10.4 22.57,10 v22.77,9.8
DSI1_CP  (via drill 0.25)
  Top 0.08: P100.53 21.92,10.9 22.27,10.55 22.27,10 v22.07,9.8
  Bottom 0.08: P102.53 21.92,10.75 22.29,10.39 22.29,10.02 v22.07,9.8
DSI1_D0N  (via drill 0.25)
  Top 0.08: P100.39 28.92,10.9 28.57,10.55 28.57,10 v28.77,9.8
  Bottom 0.08: P102.39 28.92,10.75 28.55,10.38 28.55,10.02 v28.77,9.8
DSI1_D0P  (via drill 0.25)
  Top 0.08: P100.41 27.92,10.9 28.29,10.53 28.29,10.02 v28.07,9.8
  Bottom 0.08: P102.41 27.92,10.75 28.27,10.4 28.27,10 v28.07,9.8
DSI1_D1N  (via drill 0.25)
  Top 0.08: P100.45 25.92,10.9 25.55,10.53 25.55,10.02 v25.77,9.8
  Bottom 0.08: P102.45 25.92,10.75 25.57,10.4 25.57,10 v25.77,9.8
DSI1_D1P  (via drill 0.25)
  Top 0.08: P100.47 24.92,10.9 25.27,10.55 25.27,10 v25.07,9.8
  Bottom 0.08: P102.47 24.92,10.75 25.29,10.38 25.29,10.02 v25.07,9.8
DSI1_D2N  (via drill 0.25)
  Top 0.08: P100.40 28.92,7.85 28.57,7.5 28.57,6.76 v28.78,6.56
  Bottom 0.08: P102.40 28.92,7.17 28.72,6.97 28.72,6.61 v28.78,6.56
DSI1_D2P  (via drill 0.25)
  Top 0.08: P100.42 27.92,7.85 28.29,7.48 28.29,6.84 v28.01,6.56
  Bottom 0.08: P102.42 27.92,7.15 28.12,6.95 28.12,6.67 v28.01,6.56
DSI1_D3N  (via drill 0.25)
  Top 0.08: P100.46 25.92,7.87 25.56,7.5 25.55,6.82 v25.8,6.58
  Bottom 0.08: P102.46 25.92,7.17 25.72,6.97 25.72,6.65 v25.8,6.58
DSI1_D3P  (via drill 0.25)
  Top 0.08: P100.48 24.92,7.87 25.27,7.52 25.27,6.82 v25.03,6.58
  Bottom 0.08: P102.48 24.92,7.15 25.12,6.95 25.12,6.67 v25.03,6.58
GAUGE_REG
  Top 0.1: U500.7 27.42,35.6
  Top 0.25: C504.1 27.42,35.6 27.27,35.6
GND  (via drill 0.25)
  Top 0.1: E516.1 25.72,32.97 | 25.72,32.97 25.17,32.97 | 25.17,32.97 R514.2 | 25.72,32.97 E516.1 25.17,32.97
  Top 0.2: U105.P$4 U105.P$3 U105.P$2
  Bottom 0.1: v32.54,14.81 32.21,14.81 31.72,14.32 28.52,14.32 28.07,14.77 | v27.3,14.07 27.25,14.12 25.87,14.12 | 25.92,14.17 25.87,14.12 | 25.87,14.12 22.62,14.12 22.32,14.42 | E548.1 v21.72,20.47
  other vias: 14.42,1.37 10.42,1.37 6.42,1.37 22.42,1.37 18.42,1.37 26.42,1.37 30.42,1.37 34.42,1.37 38.42,1.37 42.42,1.37 46.42,1.37 50.42,1.37 54.42,2.37 55.42,8.37 55.42,5.37 55.42,12.37 55.42,17.37 55.42,21.37 55.42,25.37 55.42,29.37 55.42,33.37 55.42,37.37 55.42,41.37 55.42,45.37 55.42,49.37 55.42,53.37 55.42,57.37 55.42,61.37 55.42,65.37 55.42,69.37 55.42,73.37 55.42,77.37 55.42,81.37 50.42,83.37 46.42,83.37 42.42,83.37 38.42,83.37 34.42,83.37 30.42,83.37 26.42,83.37 22.42,83.37 18.42,83.37 14.42,83.37 10.42,83.37 6.42,83.37 1.42,81.37 1.42,77.37 1.42,73.37 1.42,69.37 1.42,65.37 1.42,61.37 1.42,57.37 1.42,53.37 1.42,49.37 1.42,45.37 1.42,41.37 1.42,37.37 1.42,33.37 1.42,29.37 1.42,25.37 4.42,23.37 1.42,21.37 1.42,17.37 1.42,13.37 1.42,9.37 1.42,5.37 2.42,2.37 8.92,13.12 11.72,13.22 14.92,13.12 17.92,13.12 20.92,13.12 29.92,13.12 29.92,9.87 31.92,9.87 26.92,9.87 23.92,9.87 20.92,9.87 17.92,9.87 14.92,9.87 11.82,9.87 8.92,9.87 7.42,10.37 8.92,15.77 10.12,17.47 14.92,6.37 17.92,6.37 20.92,6.57 24.42,6.27 26.92,6.37 29.92,6.37 31.92,6.37 44.92,9.87 42.52,9.9 43.32,9.9 40.92,9.87 37.92,9.87 37.92,13.12 40.92,13.12 44.92,13.12 6.92,15.97 29.12,2.42 27.67,2.52 26.47,2.27 52.37,5.47 4.37,5.42 31.67,66.37 27.67,67.37 22.92,67.37 18.92,66.87 17.92,63.37 17.92,60.37 20.17,61.37 17.92,57.87 20.42,56.37 22.17,57.62 28.92,49.87 27.92,42.37 19.42,43.62 29.17,37.62 30.42,37.62 36.92,33.87 26.82,31.87 28.17,37.12 33.42,36.12 34.17,32.87 25.17,34.12 24.42,34.12 23.92,33.87 23.92,33.12 23.92,32.37 24.42,31.87 25.17,31.87 25.92,31.87 30.92,29.87 23.82,37.77 25.32,37.87 26.52,37.77 26.62,34.17 25.52,30.97 25.62,30.07 24.12,28.07 22.82,26.77 22.72,25.57 29.02,29.97 28.92,27.97 28.72,26.77 27.82,25.67 29.82,24.07 31.07,24.72 27.32,23.87 26.82,24.77 25.92,23.77 22.72,23.97 20.92,19.87 20.17,19.62 19.52,20.17 30.72,19.57 33.52,19.47 33.62,23.37 32.82,22.67 33.72,21.97 22.22,16.97 22.22,14.67 39.82,15.07 40.67,13.87 40.82,19.67 44.92,14.62 51.42,34.37 19.32,3.87 17.67,28.12 21.72,19.77 21.72,19.17
  pour Top (rank 2): 25.82,84.22 31.07,84.22 31.57,84.67 36.72,84.67 41.82,84.57 42.12,84.67 42.32,84.97 42.42,85.17 42.42,85.57 42.72,85.97 45.32,85.87 45.42,85.67 45.42,84.97 45.62,84.57 45.82,84.47 46.12,84.37 47.12,84.37 50.02,84.17 51.72,83.97 53.32,83.67 54.82,83.27 55.72,82.87 56.22,82.47 56.52,82.07 56.72,81.47 56.82,80.77 56.82,74.97 56.42,74.47 56.32,74.07 56.32,69.27 56.42,68.87 56.82,68.47 56.82,39.97 56.32,39.47 56.32,33.97 56.82,33.57 56.82,4.87 56.72,3.47 56.52,2.67 56.12,2.17 55.52,1.77 54.22,1.27 52.92,0.97 51.62,0.77 48.72,0.47 44.72,0.27 43.62,0.27 43.32,0.37 38.32,0.27 38.02,0.17 36.62,0.07 20.12,0.07 18.72,0.17 18.52,0.27 13.52,0.37 13.22,0.27 10.82,0.37 7.02,0.57 3.92,0.97 2.32,1.37 1.32,1.77 0.72,2.17 0.42,2.47 0.22,2.97 0.12,3.47 0.02,4.47 0.02,33.57 0.42,33.97 0.52,34.27 0.52,39.27 0.32,39.67 0.12,39.97 0.02,40.07 0.02,68.47 0.32,68.77 0.52,69.17 0.52,74.37 0.02,74.87 0.02,80.27 0.12,81.27 0.42,82.27 0.72,82.57 1.72,83.17 3.02,83.57 4.52,83.87 7.02,84.17 9.92,84.37 10.82,84.37 11.22,84.57 11.42,84.87 11.42,85.67 11.52,85.87 14.12,85.97 14.42,85.67 14.42,85.07 14.62,84.77 14.92,84.57 15.52,84.57 19.92,84.67 25.17,84.67 25.37,84.42
  pour Bottom (rank 2): 25.82,84.27 31.02,84.27 31.42,84.47 31.62,84.67 36.72,84.67 41.82,84.57 42.12,84.67 42.32,84.97 42.42,85.17 42.42,85.57 42.72,85.97 45.32,85.87 45.42,85.67 45.42,84.97 45.62,84.57 45.82,84.47 46.12,84.37 47.12,84.37 50.02,84.17 51.72,83.97 53.32,83.67 54.82,83.27 55.72,82.87 56.22,82.47 56.52,82.07 56.72,81.47 56.82,80.77 56.82,74.97 56.42,74.47 56.32,74.07 56.32,69.27 56.42,68.87 56.82,68.47 56.82,39.97 56.32,39.47 56.32,33.97 56.82,33.57 56.82,4.87 56.72,3.47 56.52,2.67 56.12,2.17 55.52,1.77 54.22,1.27 52.92,0.97 51.62,0.77 48.72,0.47 44.72,0.27 43.62,0.27 43.32,0.37 38.32,0.27 38.02,0.17 36.62,0.07 20.12,0.07 18.72,0.17 18.52,0.27 13.52,0.37 13.22,0.27 10.82,0.37 7.02,0.57 3.92,0.97 2.32,1.37 1.32,1.77 0.72,2.17 0.42,2.47 0.22,2.97 0.12,3.47 0.02,4.47 0.02,33.57 0.42,33.97 0.52,34.27 0.52,39.27 0.32,39.67 0.12,39.97 0.02,40.07 0.02,68.47 0.32,68.77 0.52,69.17 0.52,74.37 0.02,74.87 0.02,80.27 0.12,81.27 0.42,82.27 0.72,82.57 1.72,83.17 3.02,83.57 4.52,83.87 7.02,84.17 9.92,84.37 10.82,84.37 11.22,84.57 11.42,84.87 11.42,85.67 11.52,85.87 14.12,85.97 14.42,85.67 14.42,85.07 14.62,84.77 14.92,84.57 15.52,84.57 19.92,84.67 25.32,84.67 25.62,84.37
HSIC_DAT  (via drill 0.25)
  Top 0.35: P100.5 v45.92,13.12
  Bottom 0.35: v45.92,13.12 P102.5
HSIC_STB  (via drill 0.25)
  Top 0.35: P100.3 v46.92,13.12
  Bottom 0.35: v46.92,13.12 P102.3
ILIM
  Top 0.1: R533.2
  Top 0.25: U520.10 27.92,22.07 28.76,22.91 R533.2
LED_A
  Top 0.1: R122.2
  Top 0.2: D123.P$1 R122.2
LED_K
  Top 0.2: D123.P$2 26.62,5.87 26.22,5.47 26.22,5.37 Q121.3
OTG
  Top 0.25: U520.8 28.92,21.67 29.32,22.07 R535.2
PA0  (via drill 0.25)
  Top 0.35: P100.12 v42.92,6.37
  Bottom 0.35: v42.92,6.37 P102.12
PA1  (via drill 0.25)
  Top 0.35: P100.14 v41.92,6.37
  Bottom 0.35: v41.92,6.37 P102.14
PA2  (via drill 0.25)
  Top 0.35: P100.8 v44.92,6.37
  Bottom 0.35: v44.92,6.37 P102.8
PA3  (via drill 0.25)
  Top 0.35: P100.10 v43.92,6.37
  Bottom 0.35: v43.92,6.37 P102.10
PA4  (via drill 0.25)
  Top 0.35: P100.28 v34.92,6.37
  Bottom 0.35: v34.92,6.37 P102.28
PA5  (via drill 0.25)
  Top 0.35: P100.26 v35.92,6.37
  Bottom 0.35: v35.92,6.37 P102.26
PA6  (via drill 0.25)
  Top 0.35: P100.22 v37.92,6.37
  Bottom 0.35: v37.92,6.37 P102.22
PA7  (via drill 0.25)
  Top 0.35: P100.20 v38.92,6.37
  Bottom 0.35: v38.92,6.37 P102.20
PA9  (via drill 0.25)
  Top 0.35: P100.32 v32.92,6.37
  Bottom 0.35: v32.92,6.37 P102.32
PA10  (via drill 0.25)
  Top 0.35: P100.16 v40.92,6.37
  Bottom 0.35: v40.92,6.37 P102.16
PA15  (via drill 0.25)
  Top 0.35: P100.30 v33.92,6.37
  Bottom 0.35: v33.92,6.37 P102.30
PB2  (via drill 0.25)
  Top 0.2: v45.92,6.37 46.62,5.67 48.32,5.67 51.07,8.42 v51.07,12.57 | v51.07,14.72 51.07,18.27 39.97,29.37 R517.2 R518.1
  Top 0.35: P100.6 v45.92,6.37
  Bottom 0.15: v51.07,14.72 v51.07,12.57
  Bottom 0.35: v45.92,6.37 P102.6
PB10  (via drill 0.25)
  Top 0.1: P100.54 21.92,6.97 v21.52,6.57 20.82,5.87 19.17,5.87 18.42,5.12 17.92,5.12 | 17.92,5.12 7.37,5.12 4.92,7.57 4.92,15.12 5.25,15.45 EE_SCL.TP 7.5,15.45 8.12,16.07 8.12,16.67 8.3,16.85 D125.P$1 U105.P$6 | v17.93,5.67 17.93,5.15 17.92,5.12 | v50.32,4.67 50.02,4.97 49.43,4.97 47.96,3.51 21.06,3.51 20.52,2.97 18.43,2.97 v17.93,3.47 | v23.17,36.37 23.42,36.12 U500.3 | U520.5 30.82,20.27 v31.02,20.07 31.32,20.37 D537.P$1
  Bottom 0.1: v23.17,36.37 20.82,36.37 20.51,36.69 20.46,36.69 20.46,38.01 23.79,41.34 32.31,41.34 34.89,38.76 34.89,25.89 30.62,21.62 30.62,20.47 v31.02,20.07 31.57,20.62 42.42,20.62 48.82,14.22 48.82,7.28 49.79,6.32 49.79,5.21 v50.32,4.67 | v17.93,5.67 v17.93,3.47
  Bottom 0.35: P102.54 21.92,6.97 v21.52,6.57
PB11  (via drill 0.25)
  Top 0.1: P100.52 22.92,7.67 22.82,7.57 22.82,6.67 v22.72,6.57 22.27,6.12 21.42,6.12 20.92,5.62 19.42,5.62 18.67,4.87 18.52,4.87 | 18.52,4.87 7.22,4.87 4.67,7.42 4.67,17.12 5.54,17.99 EE_SDA.TP 7.06,16.85 D126.P$1 8.17,17.6 U105.P$5 | v50.32,5.37 50.07,5.17 49.32,5.17 47.86,3.71 20.96,3.71 20.42,3.17 19.32,3.17 18.52,3.97 18.52,4.87 | U500.4 22.7,35.62 v22.67,35.65 | U520.6 30.84,20.77 30.93,20.86 v31.12,20.86 31.43,20.86 D536.P$1
  Bottom 0.1: v22.67,35.65 22.2,36.12 20.62,36.12 20.17,36.57 20.17,38.12 23.67,41.62 32.42,41.62 35.17,38.87 35.17,25.77 31.12,21.72 v31.12,20.86 42.61,20.86 49.12,14.35 49.12,7.41 50.02,6.51 50.02,5.67 v50.32,5.37
  Bottom 0.35: P102.52 22.92,6.77 v22.72,6.57
PC0  (via drill 0.25)
  Top 0.35: P100.4 v46.92,6.37
  Bottom 0.35: P102.4 v46.92,6.37
PC1  (via drill 0.25)
  Top 0.35: P100.2 v47.92,6.37
  Bottom 0.35: P102.2 v47.92,6.37
PC3  (via drill 0.25)
  Top 0.1: 12.92,8.87 P100.72 12.92,8.12
  Top 0.35: 12.92,8.12 v12.92,6.37
  Bottom 0.35: P102.72 v12.92,6.37
PC7  (via drill 0.25)
  Top 0.1: U520.7 29.42,21.47 29.62,21.67 32.42,21.67 | 32.42,21.67 32.79,21.67 | v33.52,21.27 33.25,21 D532.P$1 R531.2 32.42,21.67 | P100.23 36.92,9.97 37.42,9.47 48.22,9.47 50,11.25 v50,13.12
  Top 0.35: v36.92,13.12 P100.23
  Bottom 0.1: v33.52,21.27 33.62,21.17 42.72,21.17 49.42,14.47 49.42,13.7 v50,13.12
  Bottom 0.35: P102.23 v36.92,13.12
PC8  (via drill 0.25)
  Top 0.35: P100.18 v39.92,6.37
  Bottom 0.35: v39.92,6.37 P102.18
PC9  (via drill 0.25)
  Top 0.3: P100.33 v31.92,13.12
  Bottom 0.35: v31.92,13.12 P102.33
PC12  (via drill 0.25)
  Top 0.35: 11.92,8.37 P100.74 v11.92,6.37
  Bottom 0.35: P102.74 v11.92,6.37
PC14  (via drill 0.25)
  Top 0.35: P100.25 v35.92,13.12
  Bottom 0.35: v35.92,13.12 P102.25
PC15  (via drill 0.25)
  Top 0.35: P100.27 v34.92,13.12
  Bottom 0.35: v34.92,13.12 P102.27
PD6  (via drill 0.25)
  Top 0.35: P100.24 v36.92,6.37
  Bottom 0.35: v36.92,6.37 P102.24
PD7  (via drill 0.25)
  Top 0.35: P100.31 v32.92,13.12
  Bottom 0.35: v32.92,13.12 P102.31
PE7  (via drill 0.25)
  Top 0.35: P100.29 v33.92,13.12
  Bottom 0.35: v33.92,13.12 P102.29
PG9  (via drill 0.25)
  Top 0.1: v10.92,6.37 9.92,5.37 7.42,5.37 5.17,7.62 5.17,12.37 5.71,12.91 EE_WP.TP 6.71,12.91 9.65,15.85 D124.P$1 R108.2 9.55,16.44 9.32,16.67 9.32,17.37 9.17,17.52 U105.P$7
  Top 0.35: P100.76 v10.92,6.37
  Bottom 0.35: P102.76 v10.92,6.37
PG10  (via drill 0.25)
  Top 0.1: Q539.1 v32.02,24.67 | v32.02,26.17 31.92,26.27 22.72,26.27 10.87,14.42 9.02,14.42 7.92,13.32 7.92,6.37 8.42,5.87 9.42,5.87 v9.92,6.37
  Top 0.2: R540.1 32.55,23.97 Q539.1
  Top 0.35: P100.78 v9.92,6.37
  Bottom 0.15: v32.02,26.17 v32.02,24.67
  Bottom 0.35: v9.92,6.37 P102.78
PG12  (via drill 0.25)
  Top 0.1: P100.80 8.92,8.87 8.52,9.27 8.52,13.27 8.97,13.72 11.17,13.72 v11.67,14.22
  Top 0.25: U500.8 v28.17,36.12
  Top 0.35: 8.92,8.37 P100.80 v8.92,6.37
  Bottom 0.1: v28.17,36.12 24.67,36.12 12.92,24.37 12.92,15.47 v11.67,14.22
  Bottom 0.35: v8.92,6.37 P102.80
PGND  (via drill 0.25)
  Top 0.1: v27.17,20.37 U520.G1
  Bottom 0.1: E548.2 U520.G1
  other vias: 30.82,16.07 31.32,16.07 31.72,14.97 25.67,18.62 25.67,18.12 25.67,17.62 29.17,20.37 29.17,18.62 27.17,18.62 23.02,22.97
  pour Bottom: 32.37,18.07 32.37,15.27 31.62,14.52 28.67,14.52 28.57,14.62 28.57,15.42 28.37,15.62 26.27,15.62 25.97,15.32 25.97,14.57 25.72,14.32 22.77,14.32 22.67,14.42 22.67,17.12 23.27,17.12 23.57,17.42 23.57,18.32 23.07,18.82 22.72,18.82 22.37,19.17 22.37,22.72 22.67,23.12 23.32,23.12 23.62,22.82 25.82,22.82 25.92,22.92 26.57,22.92 26.57,21.07 26.72,20.92 29.57,20.92 29.57,18.52 31.92,18.52
  pour Top: 22.87,23.12 23.12,23.12 23.27,22.97 23.27,21.52 23.17,21.42 22.87,21.42 22.77,21.52 22.77,23.02
  pour Top: 24.37,18.92 26.57,18.92 26.57,18.17 25.52,17.12 24.37,17.12
  pour Top: 31.67,14.62 30.77,14.62 30.57,14.82 30.57,16.12 30.67,16.22 32.17,16.22 32.37,16.02 32.37,15.32
PH0  (via drill 0.25)
  Top 0.35: P100.70 v13.92,6.37
  Bottom 0.35: P102.70 v13.92,6.37
PM_SW
  pour Top: 27.57,17.92 26.77,17.92 25.27,16.42 24.82,16.42 24.67,16.27 24.67,14.37 25.52,14.37 25.67,14.52 25.67,15.52 26.22,16.07 26.72,16.07 26.72,16.67 26.77,16.72 27.27,16.72 27.57,17.02
PM_TS
  Top 0.25: R546.1 R547.1 27.17,22.37 27.4,22.14 27.4,21.37 U520.11
PMID
  pour Top: 28.77,17.87 29.07,17.87 29.07,17.17 29.77,16.47 29.77,14.57 29.07,14.57 29.07,15.67 28.77,15.97
POWERGOOD
  Top 0.1: Q121.1 24.31,5.67 U120.2
PSEL
  Top 0.25: U520.2 30.72,18.77 31.57,19.62 R534.2
TE  (via drill 0.25)
  Top 0.3: P100.35 v30.92,13.12
  Bottom 0.35: v30.92,13.12 P102.35
THERM_PWR
  Top 0.25: R503.1 U500.9
USB_DN  (via drill 0.25)
  Top 0.1: v10.12,9.8 10.27,9.95 10.27,10.55 9.92,10.9 P100.77 9.92,11.52
  Bottom 0.1: P102.77 9.92,10.75 10.27,10.4 10.27,9.95 v10.12,9.8
USB_DP  (via drill 0.25)
  Top 0.1: P100.75 10.92,10.9 10.57,10.55 10.57,10 v10.77,9.8
  Bottom 0.1: P102.75 10.92,10.75 10.57,10.4 10.57,10 v10.77,9.8
VBUS  (via drill 0.25)
  Top 0.3: P100.11 P102.11
  Top 0.7: P102.11 v42.92,13.62
  Bottom 0.4: P102.11 42.92,12.77
  Bottom 0.8: 42.92,12.77 v42.92,13.12 v42.92,13.62
  other vias: 32.82,17.27 33.02,17.77 33.52,17.87
  pour Bottom: 33.82,19.07 41.92,19.07 44.37,16.62 44.37,14.37 43.47,13.47 43.47,13.22 43.17,12.92 42.72,12.92 40.12,15.52 33.97,15.52 32.67,16.82 32.67,17.92
  pour Top: 33.77,18.42 33.77,16.82 30.32,16.82 29.77,17.37 29.77,18.42
VREGN
  Top 0.2: R538.1 30.42,25.37
  Top 0.25: 28.03,14.87 28.02,14.86 28.02,14.67 28.62,14.07 33.32,14.07 34.42,15.17 34.42,19.97 | 34.42,19.97 33.32,19.97 32.97,19.62 R534.1 | 34.42,19.97 34.42,23.67 32.72,25.37 30.42,25.37 28.92,25.37 27.92,24.37 R546.2
  pour Top: 28.27,17.87 28.57,17.87 28.57,14.72 28.47,14.62 27.57,14.62 27.57,15.62 28.27,16.32
VSYS  (via drill 0.25)
  Top 0.35: P100.17 v39.92,13.12
  Bottom 0.35: v39.92,13.12 P102.17
  other vias: 22.92,17.97 22.42,17.97 21.92,17.97
  pour Bottom: 39.47,10.82 39.67,10.62 40.02,10.62 40.47,11.07 40.47,13.42 40.27,13.62 40.27,13.92 39.32,14.87 33.27,14.87 32.82,14.42 32.12,14.42 31.82,14.12 27.97,14.12 27.52,13.67 27.12,13.67 26.87,13.92 22.47,13.92 21.77,14.62 21.77,17.12 22.02,17.37 22.92,17.37 23.17,17.62 23.17,18.17 22.72,18.62 21.32,18.62 20.32,17.62 20.32,14.22 21.42,13.12 26.42,13.12 26.62,12.92 27.22,12.92 27.42,13.12 29.42,13.12 29.97,13.67 39.07,13.67 39.47,13.27
  pour Top: 26.62,19.92 25.07,19.92 23.97,21.02 23.27,21.02 23.27,19.22 22.77,19.22 22.77,18.92 22.47,18.62 22.02,18.62 21.77,18.37 21.77,17.62 21.92,17.47 22.42,17.47 22.77,17.12 22.77,14.42 23.97,14.42 23.97,18.92 24.22,19.17 26.62,19.17
(copper drawn outside any net)
  shapes: Bottom circle x12, Top circle x12